# EAGLE schematic Remote_Schematic  (EAGLE 9.6.2)
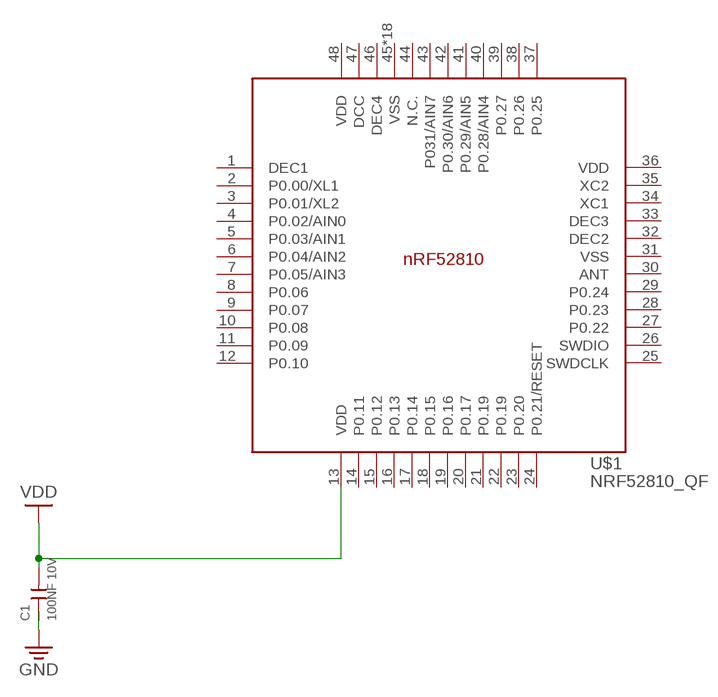
[diagram p0: schematic, sheet 1]

## Parts
C1  100NF 10V  CERAMIC 100NF-10V-10%-X5R(0402)  [C0402]
U$1  NRF52810_QF  [QFN40P600X600X90-48_N]

## Nets
GND: C1.1
VDD: C1.2 U$1.13(VDD)
Unconnected: U$1.1(DEC1) U$1.2(P0.00/XL1) U$1.3(P0.01/XL2) U$1.4(P0.02/AIN0) U$1.5(P0.03/AIN1) U$1.6(P0.04/AIN2) U$1.7(P0.05/AIN3) U$1.8(P0.06) U$1.9(P0.07) U$1.10(P0.08) U$1.11(P0.09) U$1.12(P0.10) U$1.14(P0.11) U$1.15(P0.12) U$1.16(P0.13) U$1.17(P0.14) U$1.18(P0.15) U$1.19(P0.16) U$1.20(P0.17) U$1.21(P0.19) U$1.22(P0.19) U$1.23(P0.20) U$1.24(P0.21/RESET) U$1.25(SWDCLK) U$1.26(SWDIO) U$1.27(P0.22) U$1.28(P0.23) U$1.29(P0.24) U$1.30(ANT) U$1.31(VSS) U$1.32(DEC2) U$1.33(DEC3) U$1.34(XC1) U$1.35(XC2) U$1.36(VDD) U$1.37(P0.25) U$1.38(P0.26) U$1.39(P0.27) U$1.40(P0.28/AIN4) U$1.41(P0.29/AIN5) U$1.42(P0.30/AIN6) U$1.43(P031/AIN7) U$1.44(N.C.) U$1.45(VSS) U$1.46(DEC4) U$1.47(DCC) U$1.48(VDD) U$1.PAD(VSS) U$1.PAD@VIA01(VSS) U$1.PAD@VIA02(VSS) U$1.PAD@VIA03(VSS) U$1.PAD@VIA04(VSS) U$1.PAD@VIA05(VSS) U$1.PAD@VIA06(VSS) U$1.PAD@VIA07(VSS) U$1.PAD@VIA08(VSS) U$1.PAD@VIA09(VSS) U$1.PAD@VIA10(VSS) U$1.PAD@VIA11(VSS) U$1.PAD@VIA12(VSS) U$1.PAD@VIA13(VSS) U$1.PAD@VIA14(VSS) U$1.PAD@VIA15(VSS) U$1.PAD@VIA16(VSS)

## Library data of the parts
C1 = OPL_Capacitor:CERAMIC 100NF-10V-10%-X5R(0402): 302010037; MPN: CC0402KRX5R6BB104
U$1 = Nordic_nRF:NRF52810_QF: nRF52810 Features Single chip, highly flexible, 2.4 GHz multi-protocol SoC 32-bit ARM Cortex-M4 Processor 1.7v to 3.6v operation 192kB flash + 24kB RAM Supports concurrent Bluetooth low energy/ANT protocol operation Up to +4dBm output power -96dBm sensitivity, Bluetooth low energy Thread safe and run-time protected Event driven API On air compatible with nRF24L and nRF24AP series 2 data rates (2Mbps/1Mbps) PPI - maximum flexibility for power-efficient applications and code simplification Automated power management system with automatic power management of each peripheral Configurable I/O mapping for analog and digital I/O 1 x Master/Slave SPI 1 x Two-wire interface (I²C) UART (RTS/CTS) 1 x PWM (4 channels) AES HW encryption 8-channel 10/12-bit ADC Quadrature decoder 64-level analog comparator Real Time Counter (RTC) Digital microphone interface (PDM) On-chip balun Applications Bluetooth 5 connectivity processor Industrial sensors and actuators Wearables SmartHome sensors computer peripherals RF smart remotes Airfuel (A4WP) wireless charging Beacons Sports and fitness sensors Connected health products Smart watches RC Toys Interactive games Building automation